# Altium schematic sheet Power ATX.SchDoc
size A4; SheetNumber: 2; SheetTotal: 15
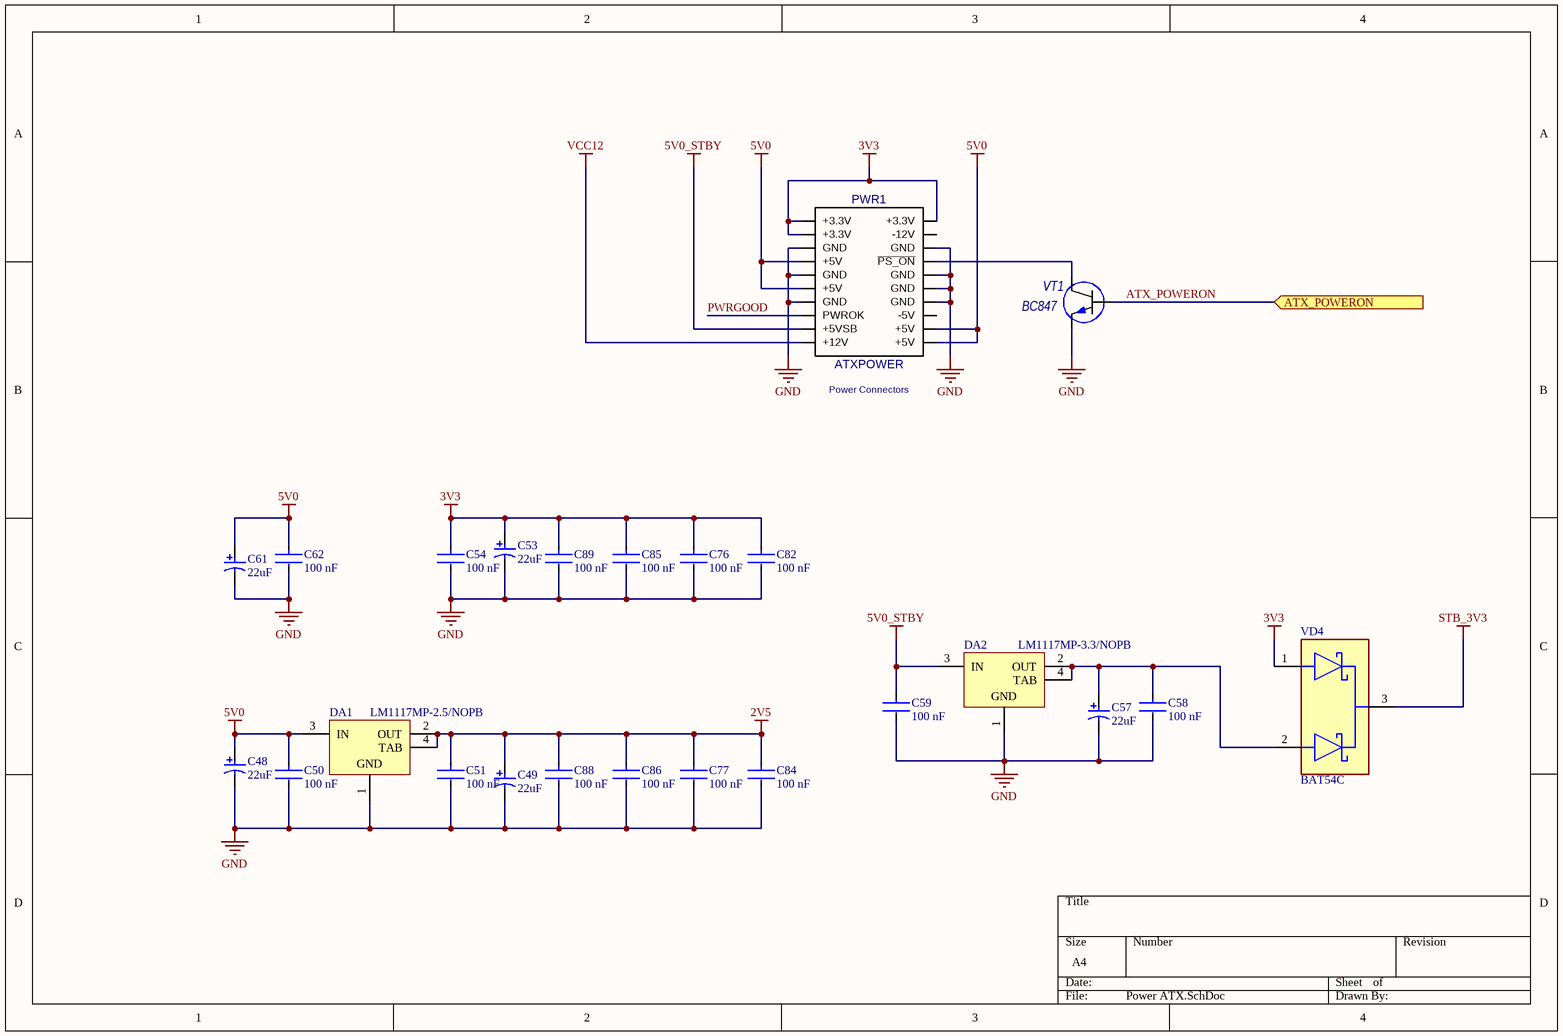
[diagram p0: Power ATX.SchDoc]

## Parts
C48  Capacitance: 22uF  [AVX-TAJ-B-2_M]  (hidden comment: TAJB226K016RNJ)
C49  Capacitance: 22uF  [AVX-TAJ-B-2_M]  (hidden comment: TAJB226K016RNJ)
C50  Capacitance: 100 nF  [FP-CC0805-0_85-IPC_A]  (hidden comment: CC0805KRX7R9BB104)
C51  Capacitance: 100 nF  [FP-CC0805-0_85-IPC_A]  (hidden comment: CC0805KRX7R9BB104)
C53  Capacitance: 22uF  [AVX-TAJ-B-2_M]  (hidden comment: TAJB226K016RNJ)
C54  Capacitance: 100 nF  [FP-CC0805-0_85-IPC_A]  (hidden comment: CC0805KRX7R9BB104)
C57  Capacitance: 22uF  [AVX-TAJ-B-2_M]  (hidden comment: TAJB226K016RNJ)
C58  Capacitance: 100 nF  [FP-CC0805-0_85-IPC_A]  (hidden comment: CC0805KRX7R9BB104)
C59  Capacitance: 100 nF  [FP-CC0805-0_85-IPC_A]  (hidden comment: CC0805KRX7R9BB104)
C61  Capacitance: 22uF  [AVX-TAJ-B-2_M]  (hidden comment: TAJB226K016RNJ)
C62  Capacitance: 100 nF  [FP-CC0805-0_85-IPC_A]  (hidden comment: CC0805KRX7R9BB104)
C76  Capacitance: 100 nF  [FP-CC0805-0_85-IPC_A]  (hidden comment: CC0805KRX7R9BB104)
C77  Capacitance: 100 nF  [FP-CC0805-0_85-IPC_A]  (hidden comment: CC0805KRX7R9BB104)
C82  Capacitance: 100 nF  [FP-CC0805-0_85-IPC_A]  (hidden comment: CC0805KRX7R9BB104)
C84  Capacitance: 100 nF  [FP-CC0805-0_85-IPC_A]  (hidden comment: CC0805KRX7R9BB104)
C85  Capacitance: 100 nF  [FP-CC0805-0_85-IPC_A]  (hidden comment: CC0805KRX7R9BB104)
C86  Capacitance: 100 nF  [FP-CC0805-0_85-IPC_A]  (hidden comment: CC0805KRX7R9BB104)
C88  Capacitance: 100 nF  [FP-CC0805-0_85-IPC_A]  (hidden comment: CC0805KRX7R9BB104)
C89  Capacitance: 100 nF  [FP-CC0805-0_85-IPC_A]  (hidden comment: CC0805KRX7R9BB104)
DA1  LM1117MP-2.5/NOPB  [DCY0004A_M]
DA2  LM1117MP-3.3/NOPB  [DCY0004A_L]
PWR1  ATXPOWER  [ATXPOWER]
VD4  BAT54C  [FP-MA03D-MFG]
VT1  BC847  [SOT-23]

## Ports
ATX_POWERON (in)

## Nets
2V5: C49.1 C51.1 C77.1 C84.1 C86.1 C88.1 DA1.2(OUT) DA1.4(TAB)
3V3: C53.1 C54.1 C76.1 C82.1 C85.1 C89.1 PWR1.1(+3.3V) PWR1.2(+3.3V) PWR1.11(+3.3V) VD4.1(1_ANODE)
5V0: C48.1 C50.1 C61.1 C62.1 DA1.3(IN) PWR1.4(+5V) PWR1.6(+5V) PWR1.19(+5V) PWR1.20(+5V)
5V0_STBY: C59.1 DA2.3(IN) PWR1.9(+5VSB)
GND: C48.2 C49.2 C50.2 C51.2 C53.2 C54.2 C57.2 C58.2 C59.2 C61.2 C62.2 C76.2 C77.2 C82.2 C84.2 C85.2 C86.2 C88.2 C89.2 DA1.1(GND) DA2.1(GND) PWR1.3(GND) PWR1.5(GND) PWR1.7(GND) PWR1.13(GND) PWR1.15(GND) PWR1.16(GND) PWR1.17(GND) VT1.2(emitter)
STB_3V3: VD4.3(COMMON_CATHODE)
VCC12: PWR1.10(+12V)
ATX_POWERON: VT1.1(base) ; port ATX_POWERON
PWRGOOD: PWR1.8(PWROK)
NetC57_1: C57.1 C58.1 DA2.2(OUT) DA2.4(TAB) VD4.2(2_ANODE)
NetPWR1_14: PWR1.14(~{PS_ON}) VT1.3(collector)

Not connected (* = marked no-connect by the designer): PWR1 12(-12V) 18(-5V)

## Notes on the sheet
- (near PWR1) Power Connectors

## Library data of the parts
C48 C49 C53 C57 C61 = CMP-2100-03689-1: Standard Tantalum, 22 uF, +/- 10%, 16 V, -55 to 125 degC, 2-Pin SMD (1210), RoHS, Tape and Reel; Manufacturer: Kyocera AVX; value: 22uF; Number of Pins: 2; Termination: SMD/SMT; Case/Package: 1210; Manufacturer Part Number: TAJB226K016RNJ; Category: Cap
C50 C51 C54 C58 C59 C62 C76 C77 C82 C84-C86 C88 C89 = CMP-2100-03606-3: CAP CER 0.1UF 50V X7R 0805; Manufacturer: Yageo; Value: 100 nF; Manufacturer Part Number: CC0805KRX7R9BB104; Category: Cap; Case/Package: 0805
DA1 = CMP-0062-01660-4: 800mA Low-Dropout Linear Regulator, 4-pin SOT-223, Pb-Free; Manufacturer: TI National Semiconductor; PartNumber: LM1117MP-2.5/NOPB; PackageDescription: Molded SOT-223, 6.50 x 3.56 x 1.6mm Body, 4 Lead, 2.3mm Pitch; Manufacturer Part Number: LM1117MP-2.5/NOPB; value: LM1117MP-2.5/NOPB; Case/Package: SOT-223; Category: IC
DA2 = CMP-0062-01638-4: 800mA Low-Dropout Linear Regulator, 4-pin SOT-223, Pb-Free; Manufacturer: TI National Semiconductor; PackageDescription: Molded SOT-223, 6.50 x 3.56 x 1.6mm Body, 4 Lead, 2.3mm Pitch; PartNumber: LM1117MP-3.3/NOPB; Manufacturer Part Number: LM1117MP-3.3/NOPB; value: LM1117MP-3.3/NOPB; Case/Package: SOT-223; Category: IC
PWR1 = ATXPOWER: Analogs: MF-20MA;N42GP-20; Value: ATXPOWER; Case/Package: Mini-Fit 20 PIN 5.2; Category: Connector
VD4 = CMP-07162-000010-1: DIODE ARRAY SCHOTTKY 30V SOT23-3; Manufacturer: ON Semiconductor / Fairchild; Capacitance: 10pF; Category: Diode; Manufacturer Part Number: BAT54C; Value: BAT54C; Case/Package: SOT-23
VT1 = BC847: Value: BC847; Case/Package: SOT-23; Category: Transistor